# EasyEDA schematic schema.json
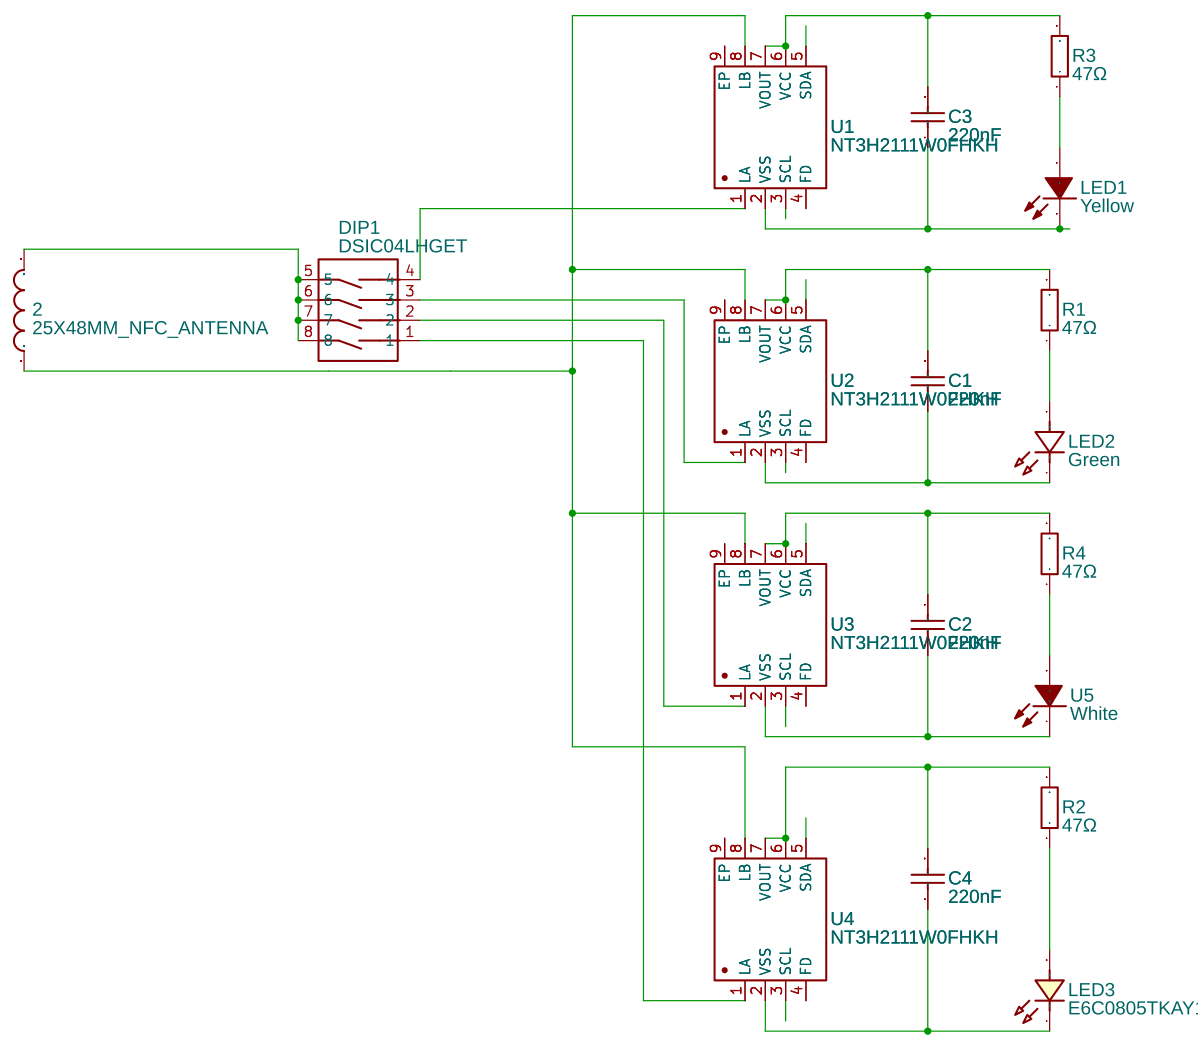
[diagram p0: schematic sheet]

## Parts
2  25X48MM_NFC_ANTENNA  [25X48MM_NFC_ANTENNA]
C1  220nF  [C0603]
C2  220nF  [C0603]
C3  220nF  [C0603]
C4  220nF  [C0603]
DIP1  DSIC04LHGET  [SW-TH_DSIC04LHGET]
LED1  Yellow  [LED0805-R-RD]
LED2  Green  [LED0805-RD_GREEN]
LED3  E6C0805TKAY1UDA  [LED0805-RD_BLUE]
R1  47Ω  [R0603]
R2  47Ω  [R0603]
R3  47Ω  [R0603]
R4  47Ω  [R0603]
U1  NT3H2111W0FHKH  [XQFN-8_L1.6-W1.6-P0.50-BL]
U2  NT3H2111W0FHKH  [XQFN-8_L1.6-W1.6-P0.50-BL]
U3  NT3H2111W0FHKH  [XQFN-8_L1.6-W1.6-P0.50-BL]
U4  NT3H2111W0FHKH  [XQFN-8_L1.6-W1.6-P0.50-BL]
U5  White  [LED0805-RD_WHITE]

## Library data of the parts
2 = 25X48MM_NFC_ANTENNA: Contributor: Joe Waldman
C1-C4 = CL10B224KA8NNNC: Supplier: LCSC; Manufacturer: SAMSUNG(三星); Supplier Part: C21120; JLCPCB Part Class: Basic Part
DIP1 = DSIC04LHGET: Supplier: LCSC; Manufacturer: YE; Supplier Part: C54959; JLCPCB Part Class: Extended Part
LED1 = 17-21SUYC/TR8: Supplier: LCSC; Manufacturer: KENTO; Manufacturer Part: KT-0805黄灯; Supplier Part: C2296; JLCPCB Part Class: Basic Part
LED2 = 绿色0805封装贴片LED灯: Contributor: lcsc; Supplier: LCSC; Supplier Part: C9900017027; Manufacturer: null; JLCPCB Part Class: Extended Part
LED3 = E6C0805TKAY1UDA: Contributor: lcsc; Supplier: LCSC; Supplier Part: C2859407; Manufacturer: ekinglux(亿晶源); JLCPCB Part Class: Extended Part
R1-R4 = 0603WAF470JT5E: Supplier: LCSC; Manufacturer: UNI-ROYAL(厚声); Supplier Part: C23182; JLCPCB Part Class: Basic Part
U1-U4 = NT3H2111W0FHKH: Contributor: LCSC; Supplier: LCSC; Supplier Part: C710403; Manufacturer: NXP(恩智浦); JLCPCB Part Class: Extended Part
U5 = 白光0805LED: Contributor: lcsc; Supplier: LCSC; Supplier Part: C9900017662; Manufacturer: null; JLCPCB Part Class: Extended Part

## Nets
Net-(2-P$1): 2.P$1 U1.8(LB) U2.8(LB) U3.8(LB) U4.8(LB)
Net-(2-P$2): 2.P$2 DIP1.5 DIP1.6 DIP1.7 DIP1.8
Net-(C1-1): C1.1 LED2.1(K) U2.2(VSS)
Net-(C1-2): C1.2 R1.2 U2.6(VCC) U2.7(VOUT)
Net-(C2-1): C2.1 U3.2(VSS) U5.1(C)
Net-(C2-2): C2.2 R4.2 U3.6(VCC) U3.7(VOUT)
Net-(C3-1): C3.1 LED1.2(-) U1.2(VSS)
Net-(C3-2): C3.2 R3.2 U1.6(VCC) U1.7(VOUT)
Net-(C4-1): C4.1 LED3.1(K) U4.2(VSS)
Net-(C4-2): C4.2 R2.2 U4.6(VCC) U4.7(VOUT)
Net-(DIP1-1): DIP1.1 U4.1(LA)
Net-(DIP1-2): DIP1.2 U3.1(LA)
Net-(DIP1-3): DIP1.3 U2.1(LA)
Net-(DIP1-4): DIP1.4 U1.1(LA)
Net-(LED1-1): LED1.1(+) R3.1
Net-(LED2-2): LED2.2(A) R1.1
Net-(LED3-2): LED3.2(A) R2.1
Net-(R4-1): R4.1 U5.2(A)

Not connected (* = marked no-connect by the designer): U1 3(SCL) 4(FD) 5(SDA) 9(EP); U2 3(SCL) 4(FD) 5(SDA) 9(EP); U3 3(SCL) 4(FD) 5(SDA) 9(EP); U4 3(SCL) 4(FD) 5(SDA) 9(EP)
